# EAGLE schematic P2-Analog_In (EAGLE 9.6.2)
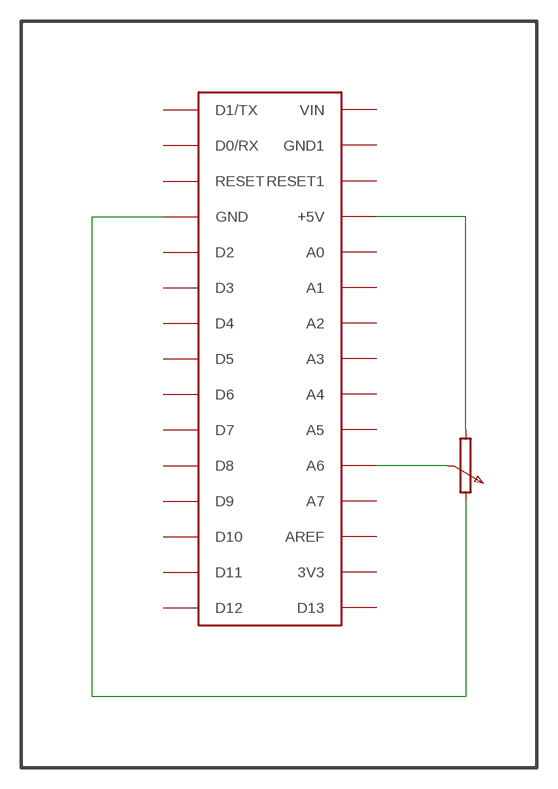
[diagram p0: schematic, sheet 1]

## Parts
U$1  ARDUINONANO  [PDIP-32]

## Nets
N$1: U$1.A6
N$2: U$1.GND
N$3: U$1.+5V
Unconnected: U$1.3V3 U$1.A0 U$1.A1 U$1.A2 U$1.A3 U$1.A4 U$1.A5 U$1.A7 U$1.AREF U$1.D0/RX U$1.D1/TX U$1.D2 U$1.D3 U$1.D4 U$1.D5 U$1.D6 U$1.D7 U$1.D8 U$1.D9 U$1.D10 U$1.D11 U$1.D12 U$1.D13 U$1.GND1 U$1.RESET U$1.RESET1 U$1.VIN

## Library data of the parts
U$1 = jet-lib:ARDUINONANO